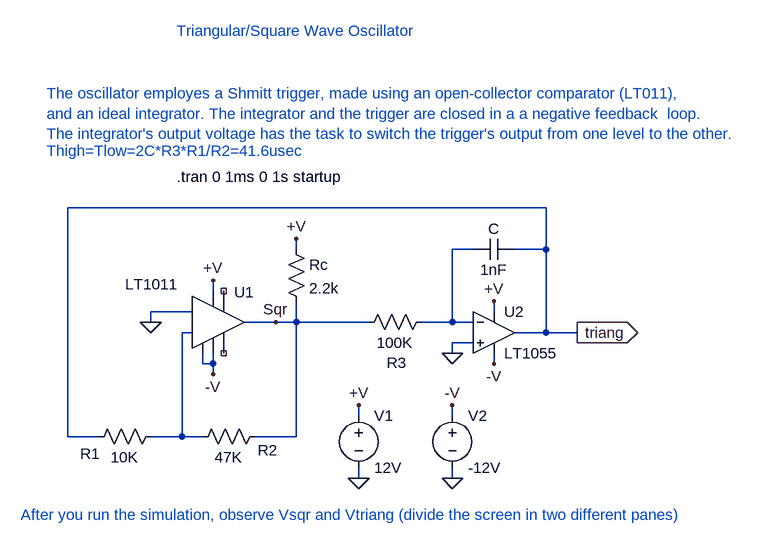
[diagram p0: schematic TriangWave1.asc]
TriangWave1.asc, the LTspice schematic file:
Version 4
SHEET 1 880 680
WIRE 416 -64 -320 -64
WIRE 32 0 32 -16
WIRE 304 0 272 0
WIRE 416 0 416 -64
WIRE 416 0 368 0
WIRE -96 64 -96 48
WIRE -128 96 -192 96
WIRE 336 96 336 80
WIRE -192 112 -192 96
WIRE 0 112 -48 112
WIRE 32 112 32 80
WIRE 32 112 0 112
WIRE 144 112 32 112
WIRE 272 112 272 0
WIRE 272 112 224 112
WIRE 304 112 272 112
WIRE -128 128 -144 128
WIRE 416 128 416 0
WIRE 416 128 368 128
WIRE 464 128 416 128
WIRE 304 144 272 144
WIRE 272 160 272 144
WIRE -112 176 -112 160
WIRE -96 176 -96 160
WIRE -96 176 -112 176
WIRE 336 176 336 160
WIRE -96 192 -96 176
WIRE 128 256 128 240
WIRE 272 256 272 240
WIRE -320 288 -320 -64
WIRE -272 288 -320 288
WIRE -144 288 -144 128
WIRE -144 288 -192 288
WIRE -112 288 -144 288
WIRE 32 288 32 112
WIRE 32 288 -32 288
WIRE 128 352 128 336
WIRE 272 352 272 336
FLAG 272 240 -V
FLAG 128 352 0
FLAG 272 352 0
FLAG -96 192 -V
FLAG 336 176 -V
FLAG 272 160 0
FLAG -192 112 0
FLAG 464 128 triang
IOPIN 464 128 Out
FLAG -96 48 +V
FLAG 128 240 +V
FLAG 336 80 +V
FLAG 0 112 Sqr
FLAG 32 -16 +V
SYMBOL res -176 272 R90
WINDOW 0 58 109 VBottom 0
WINDOW 3 32 56 VTop 0
SYMATTR InstName R1
SYMATTR Value 10K
SYMBOL res -16 272 R90
WINDOW 0 53 -4 VBottom 0
WINDOW 3 32 56 VTop 0
SYMATTR InstName R2
SYMATTR Value 47K
SYMBOL res 240 96 R90
WINDOW 0 94 54 VBottom 0
WINDOW 3 32 56 VTop 0
SYMATTR InstName R3
SYMATTR Value 100K
SYMATTR SpiceLine tol=1 pwr=0.1
SYMBOL cap 368 -16 R90
WINDOW 0 0 32 VBottom 0
WINDOW 3 32 32 VTop 0
SYMATTR InstName C
SYMATTR Value 1nF
SYMBOL voltage 128 240 R0
WINDOW 123 0 0 Left 0
SYMATTR InstName V1
SYMATTR Value 12V
SYMATTR SpiceLine Rser=0
SYMBOL voltage 272 240 R0
WINDOW 123 0 0 Left 0
SYMATTR InstName V2
SYMATTR Value -12V
SYMATTR SpiceLine Rser=0
SYMBOL Comparators\\LT1011 -96 112 R0
WINDOW 3 -135 -58 Left 0
WINDOW 0 32 -46 Left 0
SYMATTR InstName U1
SYMBOL res 16 -16 R0
SYMATTR InstName Rc
SYMATTR Value 2.2k
SYMBOL Opamps\\LT1055 336 64 R0
SYMATTR InstName U2
TEXT -152 -112 Left 0 !.tran 0 1ms 0 1s startup
TEXT -152 -336 Left 0 ;Triangular/Square Wave Oscillator
TEXT -352 -240 Left 0 ;The oscillator employes a Shmitt trigger, made using an open-collector comparator (LT011),\nand an ideal integrator. The integrator and the trigger are closed in a a negative feedback  loop.\nThe integrator's output voltage has the task to switch the trigger's output from one level to the other.
TEXT -352 -152 Left 0 ;Thigh=Tlow=2C*R3*R1/R2=41.6usec
TEXT -392 408 Left 0 ;After you run the simulation, observe Vsqr and Vtriang (divide the screen in two different panes)

The netlist it stands for:
* TriangWave1.asc
R1 N002 triang 10K
R2 Sqr N002 47K
R3 N001 Sqr 100K tol=1 pwr=0.1
C triang N001 1nF
V1 +V 0 12V Rser=0
V2 -V 0 -12V Rser=0
XU1 -V N002 0 -V NC_01 NC_02 Sqr +V LT1011
Rc +V Sqr 2.2k
XU2 0 N001 +V -V triang LT1055  ; pins In+ In- V+ V- OUT
.tran 0 1ms 0 1s startup
* Triangular/Square Wave Oscillator
* The oscillator employes a Shmitt trigger, made using an open-collector comparator (LT011),
* and an ideal integrator. The integrator and the trigger are closed in a a negative feedback  loop.
* The integrator's output voltage has the task to switch the trigger's output from one level to the other.
* Thigh=Tlow=2C*R3*R1/R2=41.6usec
* After you run the simulation, observe Vsqr and Vtriang (divide the screen in two different panes)
.lib LTC1.lib
.backanno
.end